# Altium schematic sheet PROC051D_HD Connector.SchDoc: HD Connector
size 431 x 279 mm; Date: Not shown in title block; ApprovedBy: Not shown in title block; CheckedBy: Not shown in title block; Author: Not shown in title block; CompanyName: Not shown in title block; Engineer: Not shown in title block; Organization: Not shown in title block; Address1: Not shown in title block; Address2: Not shown in title block; Address3: Not shown in title block; Address4: Not shown in title block; DocumentNumber: 10; Revision: Use project parameter SCH_Rev; SheetNumber: 10; SheetTotal: 16; PageSetup: Record=PageOptions|CenterHorizontal=True|CenterVertical=True|PrintScale=1.00|XCorrection=1.00|YCorrection=1.00|PrintKind=0|BorderSize=5000000|LeftOffset=0|BottomOffset=0|Orientation=2|PaperLength=1000|PaperWidth=1000|Scale=100|PaperSource=15|PrintQuality=600|MediaType=1|DitherType=10|PrintScaleMode=1|PaperKind=Letter; CurrentTime: Not shown in title block; CurrentDate: Not shown in title block; Time: Not shown in title block; DocumentFullPathAndName: Not shown in title block; DocumentName: Not shown in title block; ModifiedDate: Not shown in title block; ImagePath: Not shown in title block
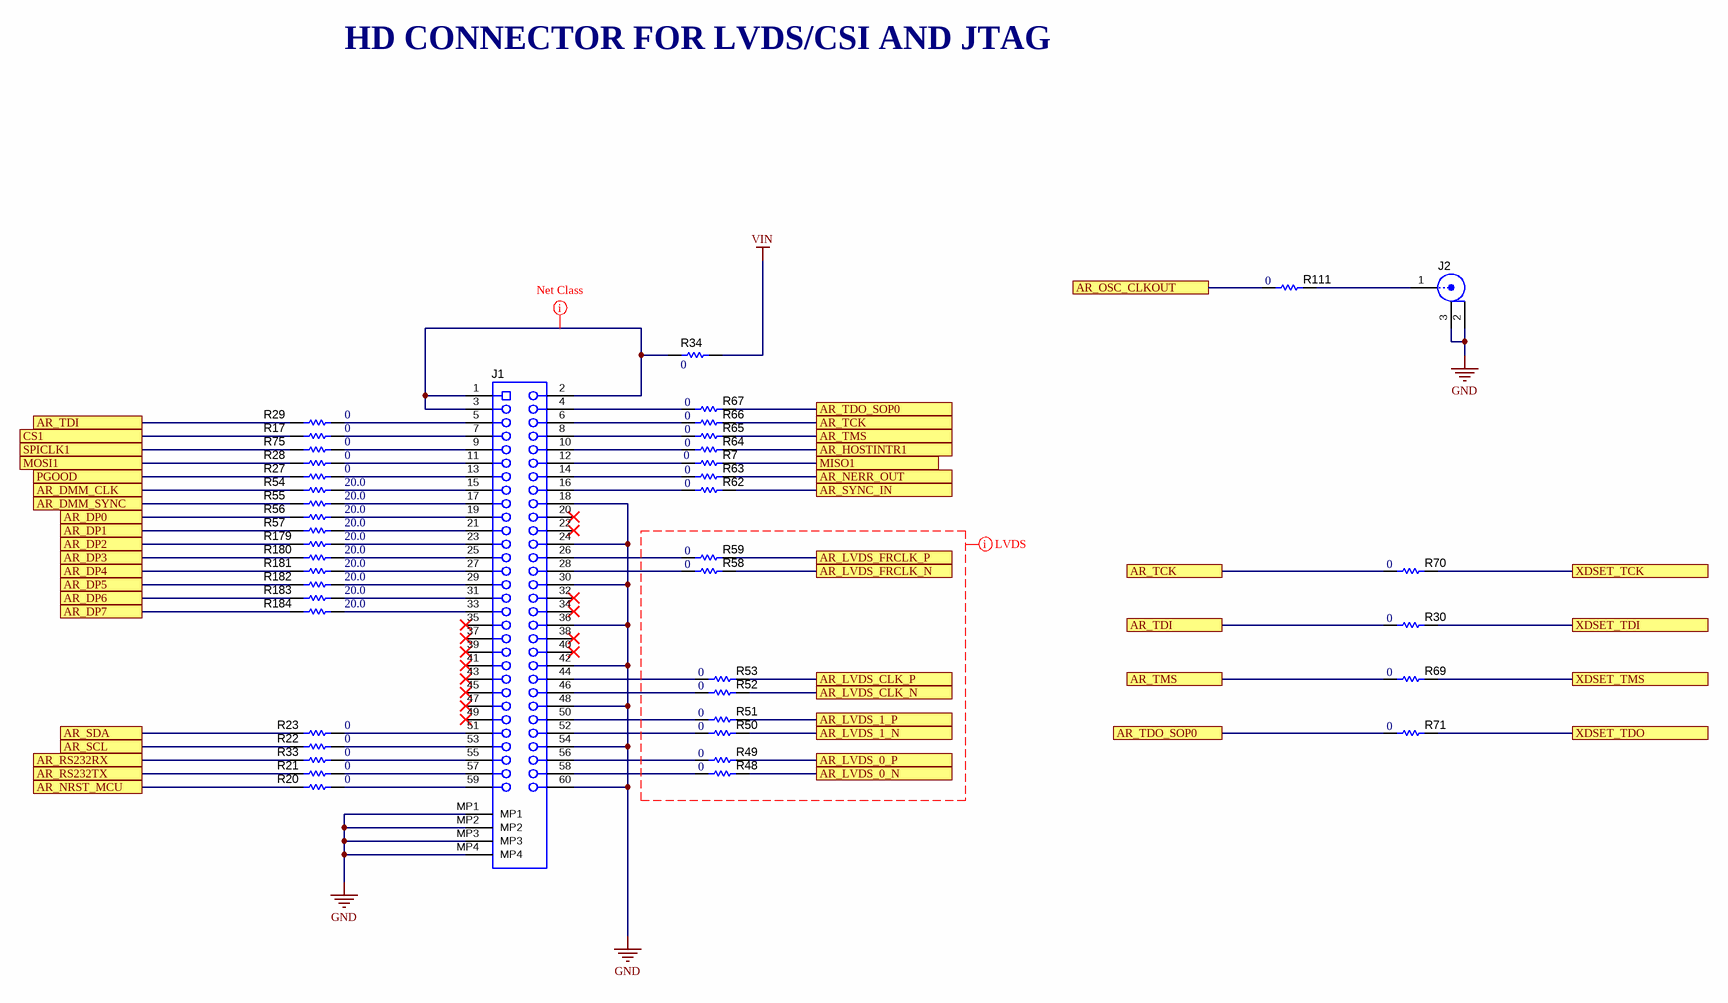
[diagram p0: PROC051D_HD Connector.SchDoc]

## Parts
J1  QSH-030-01-L-D-A  [Samtec_QSH-030-01-X-D-A]  (value not drawn)
J2  128-0711-201  [Johnson_128-0711-201]  (value not drawn)
R7  ValueDisplayed: 0  [0201_Silk]  (hidden comment: CRCW02010000Z0ED)
R17  ValueDisplayed: 0  [0201_Silk]  (hidden comment: CRCW02010000Z0ED)
R20  ValueDisplayed: 0  [0201_Silk]  (hidden comment: CRCW02010000Z0ED)
R21  ValueDisplayed: 0  [0201_Silk]  (hidden comment: CRCW02010000Z0ED)
R22  ValueDisplayed: 0  [0201_Silk]  (hidden comment: CRCW02010000Z0ED)
R23  ValueDisplayed: 0  [0201_Silk]  (hidden comment: CRCW02010000Z0ED)
R27  ValueDisplayed: 0  [0201_Silk]  (hidden comment: CRCW02010000Z0ED)
R28  ValueDisplayed: 0  [0201_Silk]  (hidden comment: CRCW02010000Z0ED)
R29  ValueDisplayed: 0  [0201_Silk]  (hidden comment: CRCW02010000Z0ED)
R30  ValueDisplayed: 0  [0201_Silk]  (hidden comment: CRCW02010000Z0ED)
R33  ValueDisplayed: 0  [0201_Silk]  (hidden comment: CRCW02010000Z0ED)
R34  ValueDisplayed: 0  [2010]  (hidden comment: CRCW20100000Z0EF)
R48  ValueDisplayed: 0  [0201_Silk]  (hidden comment: CRCW02010000Z0ED)
R49  ValueDisplayed: 0  [0201_Silk]  (hidden comment: CRCW02010000Z0ED)
R50  ValueDisplayed: 0  [0201_Silk]  (hidden comment: CRCW02010000Z0ED)
R51  ValueDisplayed: 0  [0201_Silk]  (hidden comment: CRCW02010000Z0ED)
R52  ValueDisplayed: 0  [0201_Silk]  (hidden comment: CRCW02010000Z0ED)
R53  ValueDisplayed: 0  [0201_Silk]  (hidden comment: CRCW02010000Z0ED)
R54  ValueDisplayed: 20.0  [0201_033]  (hidden comment: CRCW020120R0FNED)
R55  ValueDisplayed: 20.0  [0201_033]  (hidden comment: CRCW020120R0FNED)
R56  ValueDisplayed: 20.0  [0201_033]  (hidden comment: CRCW020120R0FNED)
R57  ValueDisplayed: 20.0  [0201_033]  (hidden comment: CRCW020120R0FNED)
R58  ValueDisplayed: 0  [0201_Silk]  (hidden comment: CRCW02010000Z0ED)
R59  ValueDisplayed: 0  [0201_Silk]  (hidden comment: CRCW02010000Z0ED)
R62  ValueDisplayed: 0  [0201_Silk]  (hidden comment: CRCW02010000Z0ED)
R63  ValueDisplayed: 0  [0201_Silk]  (hidden comment: CRCW02010000Z0ED)
R64  ValueDisplayed: 0  [0201_Silk]  (hidden comment: CRCW02010000Z0ED)
R65  ValueDisplayed: 0  [0201_Silk]  (hidden comment: CRCW02010000Z0ED)
R66  ValueDisplayed: 0  [0201_Silk]  (hidden comment: CRCW02010000Z0ED)
R67  ValueDisplayed: 0  [0201_Silk]  (hidden comment: CRCW02010000Z0ED)
R69  ValueDisplayed: 0  [0201_Silk]  (hidden comment: CRCW02010000Z0ED)
R70  ValueDisplayed: 0  [0201_Silk]  (hidden comment: CRCW02010000Z0ED)
R71  ValueDisplayed: 0  [0201_Silk]  (hidden comment: CRCW02010000Z0ED)
R75  ValueDisplayed: 0  [0201_Silk]  (hidden comment: CRCW02010000Z0ED)
R111  ValueDisplayed: 0  [0201_Silk]  (hidden comment: CRCW02010000Z0ED)
R179  ValueDisplayed: 20.0  [0201_033]  (hidden comment: CRCW020120R0FNED)
R180  ValueDisplayed: 20.0  [0201_033]  (hidden comment: CRCW020120R0FNED)
R181  ValueDisplayed: 20.0  [0201_033]  (hidden comment: CRCW020120R0FNED)
R182  ValueDisplayed: 20.0  [0201_033]  (hidden comment: CRCW020120R0FNED)
R183  ValueDisplayed: 20.0  [0201_033]  (hidden comment: CRCW020120R0FNED)
R184  ValueDisplayed: 20.0  [0201_033]  (hidden comment: CRCW020120R0FNED)

## Ports
AR_DMM_CLK, AR_DMM_SYNC, AR_DP0, AR_DP1, AR_DP2, AR_DP3, AR_DP4, AR_DP5, AR_DP6, AR_DP7, AR_HOSTINTR1, AR_LVDS_0_N, AR_LVDS_0_P, AR_LVDS_1_N, AR_LVDS_1_P, AR_LVDS_CLK_N, AR_LVDS_CLK_P, AR_LVDS_FRCLK_N, AR_LVDS_FRCLK_P, AR_NERR_OUT, AR_NRST_MCU, AR_OSC_CLKOUT, AR_RS232RX, AR_RS232TX, AR_SCL, AR_SDA, AR_SYNC_IN, AR_TCK, AR_TDI, AR_TDO_SOP0, AR_TMS, CS1, MISO1, MOSI1, PGOOD, SPICLK1, XDSET_TCK, XDSET_TDI, XDSET_TDO, XDSET_TMS

## Nets
GND: J1.18 J1.24 J1.30 J1.36 J1.42 J1.48 J1.54 J1.60 J1.MP1 J1.MP2 J1.MP3 J1.MP4 J2.2 J2.3
VIN: R34.2
AR_DMM_CLK: R54.1 ; port AR_DMM_CLK
AR_DMM_SYNC: R55.1 ; port AR_DMM_SYNC
AR_DP0: R56.1 ; port AR_DP0
AR_DP1: R57.1 ; port AR_DP1
AR_DP2: R179.1 ; port AR_DP2
AR_DP3: R180.1 ; port AR_DP3
AR_DP4: R181.1 ; port AR_DP4
AR_DP5: R182.1 ; port AR_DP5
AR_DP6: R183.1 ; port AR_DP6
AR_DP7: R184.1 ; port AR_DP7
AR_HOSTINTR1: R64.2 ; port AR_HOSTINTR1
AR_LVDS_0_N: R48.2 ; port AR_LVDS_0_N
AR_LVDS_0_P: R49.2 ; port AR_LVDS_0_P
AR_LVDS_1_N: R50.2 ; port AR_LVDS_1_N
AR_LVDS_1_P: R51.2 ; port AR_LVDS_1_P
AR_LVDS_CLK_N: R52.2 ; port AR_LVDS_CLK_N
AR_LVDS_CLK_P: R53.2 ; port AR_LVDS_CLK_P
AR_LVDS_FRCLK_N: R58.2 ; port AR_LVDS_FRCLK_N
AR_LVDS_FRCLK_P: R59.2 ; port AR_LVDS_FRCLK_P
AR_NERR_OUT: R63.2 ; port AR_NERR_OUT
AR_NRST_MCU: R20.1 ; port AR_NRST_MCU
AR_OSC_CLKOUT: R111.1 ; port AR_OSC_CLKOUT
AR_RS232RX: R33.1 ; port AR_RS232RX
AR_RS232TX: R21.1 ; port AR_RS232TX
AR_SCL: R22.1 ; port AR_SCL
AR_SDA: R23.1 ; port AR_SDA
AR_SYNC_IN: R62.2 ; port AR_SYNC_IN
AR_TCK: R66.2 R70.1 ; port AR_TCK
AR_TDI: R29.1 R30.1 ; port AR_TDI
AR_TDO_SOP0: R67.2 R71.1 ; port AR_TDO_SOP0
AR_TMS: R65.2 R69.1 ; port AR_TMS
CS1: R17.1 ; port CS1
MISO1: R7.2 ; port MISO1
MOSI1: R28.1 ; port MOSI1
PGOOD: R27.1 ; port PGOOD
SPICLK1: R75.1 ; port SPICLK1
XDSET_TCK: R70.2 ; port XDSET_TCK
XDSET_TDI: R30.2 ; port XDSET_TDI
XDSET_TDO: R71.2 ; port XDSET_TDO
XDSET_TMS: R69.2 ; port XDSET_TMS
NetJ1_1: J1.1 J1.2 J1.3 R34.1
NetJ1_4: J1.4 R67.1
NetJ1_5: J1.5 R29.2
NetJ1_6: J1.6 R66.1
NetJ1_7: J1.7 R17.2
NetJ1_8: J1.8 R65.1
NetJ1_9: J1.9 R75.2
NetJ1_10: J1.10 R64.1
NetJ1_11: J1.11 R28.2
NetJ1_12: J1.12 R7.1
NetJ1_13: J1.13 R27.2
NetJ1_14: J1.14 R63.1
NetJ1_15: J1.15 R54.2
NetJ1_16: J1.16 R62.1
NetJ1_17: J1.17 R55.2
NetJ1_19: J1.19 R56.2
NetJ1_21: J1.21 R57.2
NetJ1_23: J1.23 R179.2
NetJ1_25: J1.25 R180.2
NetJ1_26: J1.26 R59.1
NetJ1_27: J1.27 R181.2
NetJ1_28: J1.28 R58.1
NetJ1_29: J1.29 R182.2
NetJ1_31: J1.31 R183.2
NetJ1_33: J1.33 R184.2
NetJ1_44: J1.44 R53.1
NetJ1_46: J1.46 R52.1
NetJ1_50: J1.50 R51.1
NetJ1_51: J1.51 R23.2
NetJ1_52: J1.52 R50.1
NetJ1_53: J1.53 R22.2
NetJ1_55: J1.55 R33.2
NetJ1_56: J1.56 R49.1
NetJ1_57: J1.57 R21.2
NetJ1_58: J1.58 R48.1
NetJ1_59: J1.59 R20.2
NetJ2_1: J2.1 R111.2

Not connected (* = marked no-connect by the designer): J1 20* 22* 32* 34* 35* 37* 38* 39* 40* 41* 43* 45* 47* 49*

## Layout directives
net class Undefined: (no net found under the mark)
net class PWR: NetJ1_1

## Notes on the sheet
- HD CONNECTOR FOR LVDS/CSI AND JTAG
- Drawn By:
- SVN Rev:
- Number:
- TID #:
- Orderable:
- Rev:
- Sheet Title:
- File:
- Project Title:
- Designed for:
- Assembly Variant:
- Mod. Date:
- Sheet:
- Size:
- of
- B
- http://www.ti.com
- Texas Instruments and/or its licensors do not warrant the accuracy or completeness of this specification or any information contained therein. Texas Instruments and/or its licensors do not warrant that this design will meet the specifications, will be suitable for your application or fit for any particular purpose, or will operate in an implementation. Texas Instruments and/or its licensors do not warrant that the design is production worthy. You should completely validate and test your design implementation to confirm the system functionality for your application.
- Engineer:
- Contact:
- © Texas Instruments

## Library data of the parts
J1 = CMP-0075524-1: Receptacle, 0.5 mm, 30x2, Gold, TH; Manufacturer: Samtec; Pitch_mm: 0.5; Gender: Female; Green_REACh: Passed; CT: False; Shrouded: N; RowSpacing_mm: 5.73; Green_Lifecycle: Active; Row_Count: 2; ComponentLink1Description: Datasheet URL; RoHS: Y; Supplier Part Number 3: 1667876; Supplier 1: Digi-Key; Orientation: Vertical; Green_EU RoHS: Passed with Exemption; PackageReference: Receptacle, 0.5 mm, 30x2, TH; Color: Black; PartNumber: QSH-030-01-L-D-A; PinCount: 60; Publisher: Texas Instruments; Supplier Part Number 2: 19M9181; ContactFinish: Gold; Supplier 2: Newark; ComponentLink1URL: http://www.samtec.com/ftppub/cpdf/QSH-XXX-01-X-D-XX-MKT.pdf; LatestRevisionDate: 2017-07-12; CompType: Receptacle; CNHeader: False; MountType: SMT; Supplier Part Number 1: SAM8180-ND; Supplier 3: Farnell; Green_EU RoHS-2: Passed
J2 = CMP-0055788-1: UMC Straight Jack Receptacle, 50 Ohm, Gold, SMT; Manufacturer: Cinch Connectivity; CNHeader: FALSE; Gender: Female; ComponentLink1URL: https://cinchconnectivity.com/OA_MEDIA/catalog/pdf_UMCCatalogcatalog.pdf; Supplier Part Number 2: 99M0460; Publisher: Texas Instruments; Supplier 2: Newark; Supplier Part Number 3: 530-1280711201; Supplier 3: Mouser; RoHS: Y; MountType: SMT; Supplier 1: Digi-Key; PackageReference: UMC Straight Jack Receptacle, SMT; PinCount: 3; CompType: Jack; LatestRevisionDate: 26/05/2017; PartNumber: 128-0711-201; Orientation: Vertical; ComponentLink1Description: Datasheet URL; Supplier Part Number 1: J983CT-ND; ContactFinish: Gold; CT: FALSE
R7 R17 R20-R23 R27-R30 R33 R48-R53 R58 R59 R62-R67 R69-R71 R75 R111 = CMP-0027008-4: RES, 0, 5%, 0.05 W, 0201; Manufacturer: Vishay-Dale; Power_W: 50mW; TempCo: ppm/C; Value_Code: 0000; Value: 0; EIA_Code: E24; SizeX_mm: 0.6; SizeY_mm: 0.3; SizeZ_mm: 0.26; Value2: 0.05W; SizeArea_mm2: 0.18; AEC Qualified: N; AEC Category: Q200; RoHS: E; Value1: 5%; MountType: SMT; Supplier 1: Newark; PackageReference: 0201; Tolerance_%: 5%; Res_ohm: 0; CompType: Resistor; PartNumber: CRCW02010000Z0ED; ComponentLink1Description: Datasheet link; AEC Grade: N/A; Supplier Part Number 1: 72M6743; Technology: Thick Film; ComponentLink1URL: http://www.vishay.com/docs/20052/crcw0201e3.pdf
R34 = CMP-0016044-3: RES, 0, 5%, 0.75 W, AEC-Q200 Grade 0, 2010; Manufacturer: Vishay-Dale; Power_W: 750mW; TempCo: ppm/C; Value_Code: 0000; Value: 0; EIA_Code: E24; SizeX_mm: 5; SizeY_mm: 2.5; SizeZ_mm: 1.66; Value2: 0.75W; SizeArea_mm2: 12.5; AEC Qualified: Y; AEC Category: Q200; RoHS: E; Value1: 5%; MountType: SMT; Supplier 1: Digi-Key; PackageReference: 2010; Tolerance_%: 5%; Res_ohm: 0; CompType: Resistor; PartNumber: CRCW20100000Z0EF; ComponentLink1Description: Datasheet link; AEC Grade: 0; Supplier Part Number 1: 541-0.0WCT-ND; Technology: Thick Film; ComponentLink1URL: http://www.vishay.com/docs/20035/dcrcwe3.pdf
R54-R57 R179-R184 = CMP-0078192-2: RES, 20.0, 1%, 0.05 W, 0201; Manufacturer: Vishay-Dale; Value_Code: 20R0; SizeArea_mm2: 0.18; AEC Qualified: N; AEC Category: Q200; Res_ohm: 20; Value: 20.0; SizeZ_mm: 0.33; EIA_Code: E96; TempCo: 200 ppm/C; Power_W: 50mW; VDC_V: 30V; SizeY_mm: 0.3; Value2: 0.05W; SizeX_mm: 0.6; ComponentLink1Description: Datasheet link; RoHS: E; Supplier Part Number 3: 71-CRCW020120R0FNED; Tolerance_%: 1%; Supplier 1: Digi-Key; PackageReference: 0201; Technology: Thick Film; PartNumber: CRCW020120R0FNED; Supplier Part Number 2: 87W8830; Supplier 2: Newark; AEC Grade: N/A; ComponentLink1URL: http://www.vishay.com/docs/20052/crcw0201e3.pdf; Value1: 1%; CompType: Resistor; MountType: SMT; Supplier Part Number 1: 541-2947-1-ND; Supplier 3: Mouser